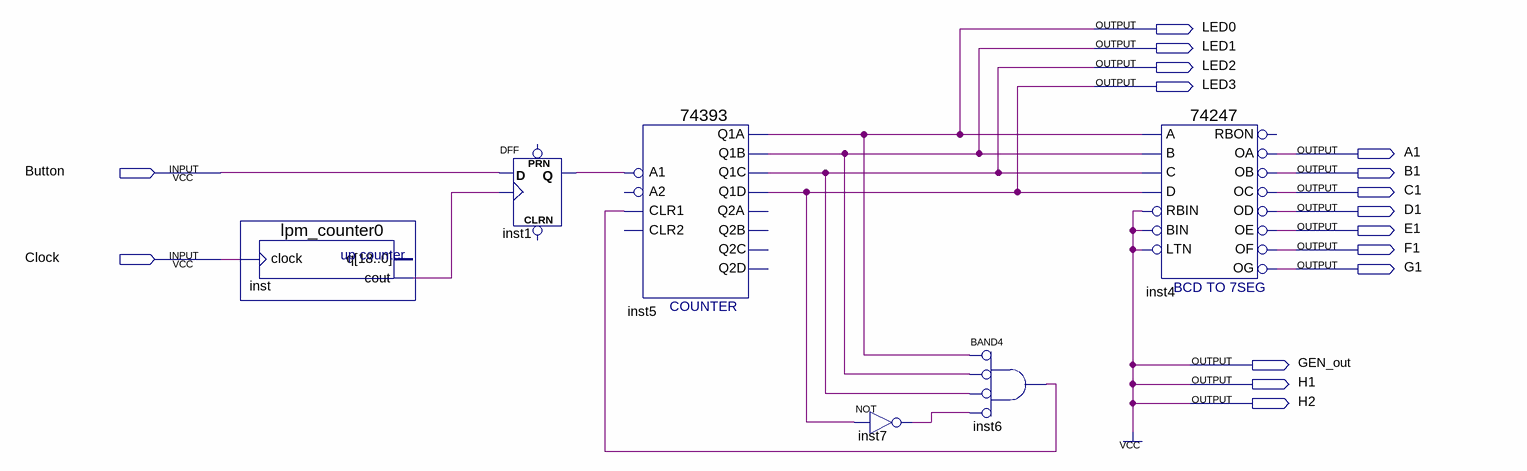
[diagram p0: schematic sheet]
// Quartus schematic lab6_3.bdf as structural Verilog: 6 symbols, 16 pins
module lab6_3 (
  input  Button,
  input  Clock,
  output LED0,
  output LED1,
  output LED2,
  output LED3,
  output A1,
  output B1,
  output C1,
  output D1,
  output E1,
  output F1,
  output G1,
  output GEN_out,
  output H1,
  output H2
);

  wire inst1_q, inst6_out, inst7_out, inst_cout;

  lpm_counter0 inst (.clock(Clock), .cout(inst_cout));  // open: q
  DFF inst1 (.CLK(inst_cout), .D(Button), .Q(inst1_q));  // open: CLRN, PRN
  \74393  inst5 (
    .A1(inst1_q), .CLR1(inst6_out), .Q1C(LED2), .Q1D(LED3), .Q1A(LED0), .Q1B(LED1));  // open: A2, CLR2, Q2D, Q2C, Q2B, Q2A
  not inst7 (inst7_out, LED3);
  and inst6 (inst6_out, ~LED0, ~LED1, ~LED2, ~inst7_out);  // BAND4
  \74247  inst4 (
    .LTN(1'b1), .BIN(1'b1), .A(LED0), .B(LED1), .RBIN(1'b1), .C(LED2), .D(LED3), .OF(F1), .OC(C1), .OD(D1),
    .OE(E1), .OA(A1), .OB(B1), .OG(G1));  // open: RBON

  assign GEN_out = 1'b1;
  assign H1 = 1'b1;
  assign H2 = 1'b1;
endmodule
